# Altium schematic sheet schematic.schdoc
size 546 x 375 mm
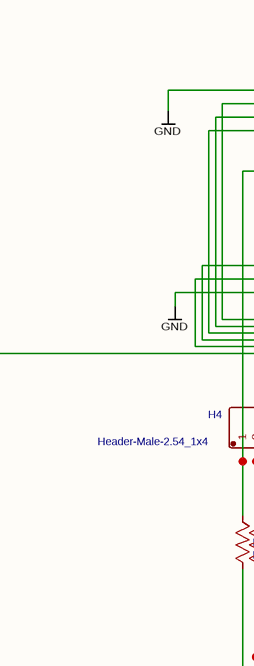
[diagram p0: schematic.schdoc, top left]
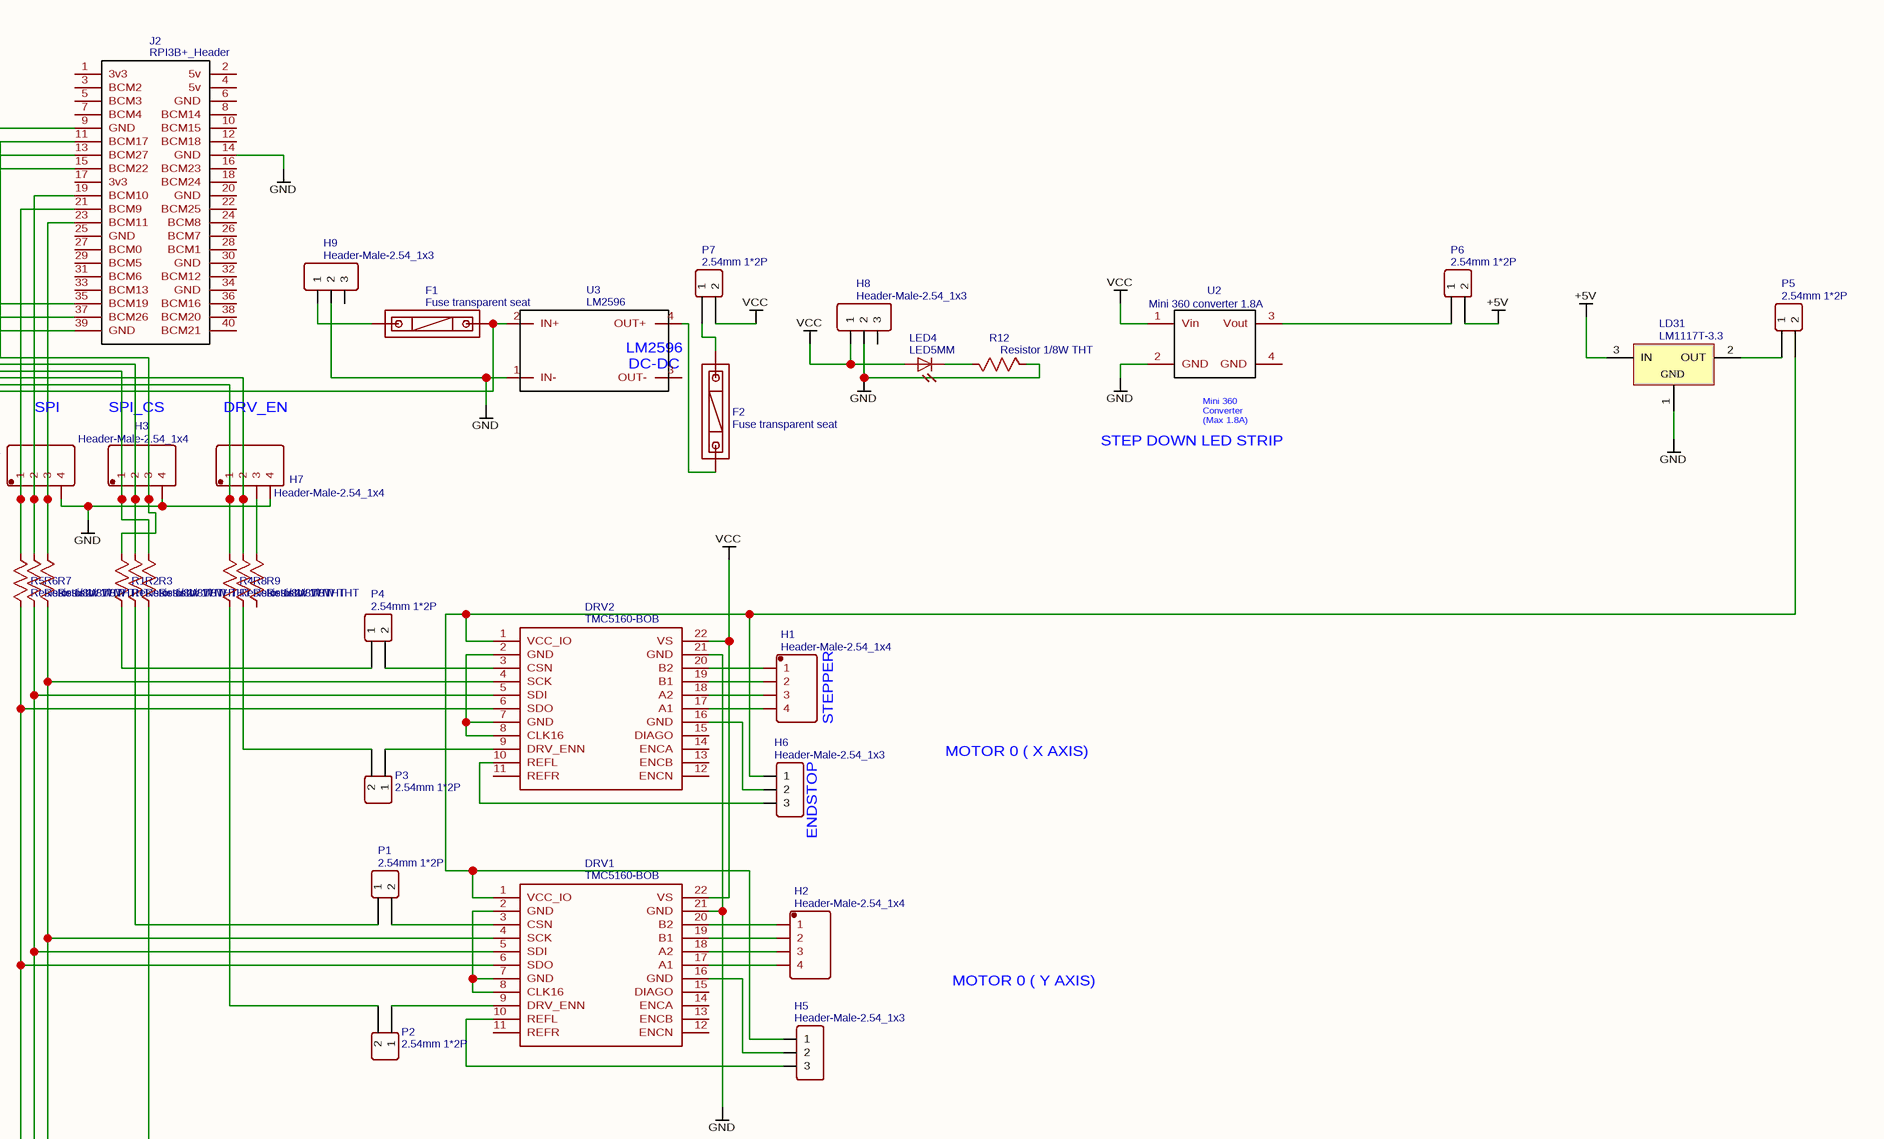
[diagram p1: schematic.schdoc, top right]
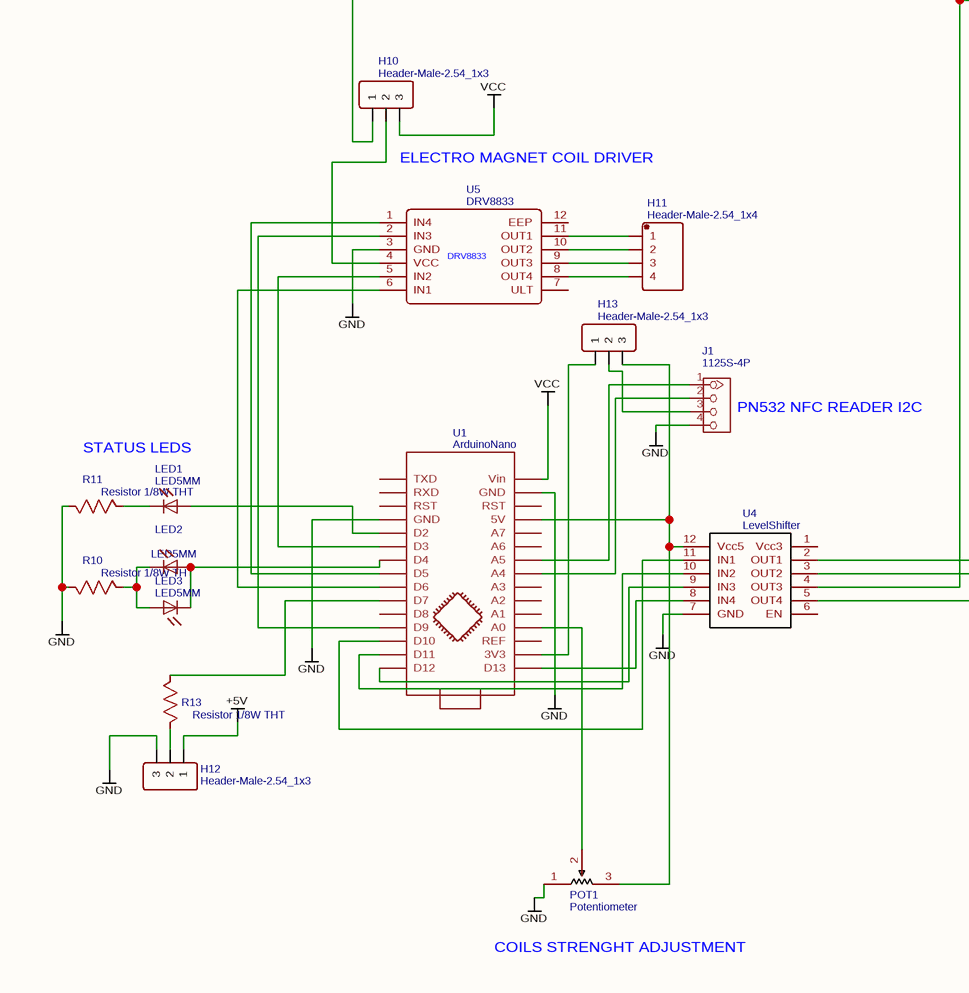
[diagram p2: schematic.schdoc, bottom left]

## Parts
DRV1  TMC5160-BOB  [TMC5160-BOB]
DRV2  TMC5160-BOB  [TMC5160-BOB]
F1  Fuse transparent seat  [FUSE-TH_L22.6-W9.0]
F2  Fuse transparent seat  [FUSE-TH_L22.6-W9.0]
H1  Header-Male-2.54_1x4  [HDR-TH_4P-P2.54-V]
H2  Header-Male-2.54_1x4  [HDR-TH_4P-P2.54-V]
H3  Header-Male-2.54_1x4  [HDR-TH_4P-P2.54-V]
H4  Header-Male-2.54_1x4  [HDR-TH_4P-P2.54-V]
H5  Header-Male-2.54_1x3  [HDR-TH_3P-P2.54-V]
H6  Header-Male-2.54_1x3  [HDR-TH_3P-P2.54-V]
H7  Header-Male-2.54_1x4  [HDR-TH_4P-P2.54-V]
H8  Header-Male-2.54_1x3  [HDR-TH_3P-P2.54-V]
H9  Header-Male-2.54_1x3  [HDR-TH_3P-P2.54-V]
H10  Header-Male-2.54_1x3  [HDR-TH_3P-P2.54-V]
H11  Header-Male-2.54_1x4  [HDR-TH_4P-P2.54-V]
H12  Header-Male-2.54_1x3  [HDR-TH_3P-P2.54-V]
H13  Header-Male-2.54_1x3  [HDR-TH_3P-P2.54-V]
J1  1125S-4P  [HW4-2.0]
J2  RPI3B+_Header  [2X20_2.54_HEADER]
LD31  LM1117T-3.3  [T03B]
LED1  LED5MM  [LED5MM]
LED2  LED5MM  [LED5MM]
LED3  LED5MM  [LED5MM]
LED4  LED5MM  [LED5MM]
P1  2.54mm 1*2P  [HDR-TH_2P-P2.54-V-M]
P2  2.54mm 1*2P  [HDR-TH_2P-P2.54-V-M]
P3  2.54mm 1*2P  [HDR-TH_2P-P2.54-V-M]
P4  2.54mm 1*2P  [HDR-TH_2P-P2.54-V-M]
P5  2.54mm 1*2P  [HDR-TH_2P-P2.54-V-M]
P6  2.54mm 1*2P  [HDR-TH_2P-P2.54-V-M]
P7  2.54mm 1*2P  [HDR-TH_2P-P2.54-V-M]
POT1  Potentiometer  [MY_POT]
R1  Resistor 1/8W THT  [RESISTOR 1/8W THT]
R2  Resistor 1/8W THT  [RESISTOR 1/8W THT]
R3  Resistor 1/8W THT  [RESISTOR 1/8W THT]
R4  Resistor 1/8W THT  [RESISTOR 1/8W THT]
R5  Resistor 1/8W THT  [RESISTOR 1/8W THT]
R6  Resistor 1/8W THT  [RESISTOR 1/8W THT]
R7  Resistor 1/8W THT  [RESISTOR 1/8W THT]
R8  Resistor 1/8W THT  [RESISTOR 1/8W THT]
R9  Resistor 1/8W THT  [RESISTOR 1/8W THT]
R10  Resistor 1/8W THT  [RESISTOR 1/8W THT]
R11  Resistor 1/8W THT  [RESISTOR 1/8W THT]
R12  Resistor 1/8W THT  [RESISTOR 1/8W THT]
R13  Resistor 1/8W THT  [RESISTOR 1/8W THT]
U1  ArduinoNano  [ARDUINO NANO VINCENT]
U2  Mini 360 converter 1.8A  [MINI 360 STEP DOWN CONVERTER 1.8A]
U3  LM2596  [STEP_DOWN_LM2596S]
U4  LevelShifter  [12PIN]
U5  DRV8833  [DRV8833 MOTOR DRIVER]

## Nets
+5V: H12.1 LD31.3(IN) P6.2
GND: DRV1.21(GND) DRV2.21(GND) H3.4 H4.4 H7.4 H8.2 H9.2 H12.3 J1.4 J2.9(GND) J2.14(GND) J2.39(GND) LD31.1(GND) POT1.1 R10.2 R11.2 R12.2 U1.4(GND) U1.29(GND) U2.2(GND) U3.1(IN-) U4.7(GND) U5.3(GND)
VCC: DRV1.22(VS) DRV2.22(VS) H8.1 H10.3 LED4.A P7.2 U1.30(Vin) U2.1(Vin)
NetDRV1_1: DRV1.1(VCC_IO) DRV2.1(VCC_IO) H5.1 H6.1 P5.2
NetDRV1_2: DRV1.2(GND) DRV1.7(GND) DRV1.8(CLK16)
NetDRV1_3: DRV1.3(CSN) P1.2
NetDRV1_4: DRV1.4(SCK) DRV2.4(SCK) R7.1 U4.5(OUT4)
NetDRV1_5: DRV1.5(SDI) DRV2.5(SDI) R6.1 U4.3(OUT2)
NetDRV1_6: DRV1.6(SDO) DRV2.6(SDO) R5.1 U4.4(OUT3)
NetDRV1_9: DRV1.9(DRV_ENN) P2.1
NetDRV1_10: DRV1.10(REFL) H5.3
NetDRV1_16: DRV1.16(GND) H5.2
NetDRV1_17: DRV1.17(A1) H2.4
NetDRV1_18: DRV1.18(A2) H2.3
NetDRV1_19: DRV1.19(B1) H2.2
NetDRV1_20: DRV1.20(B2) H2.1
NetDRV2_2: DRV2.2(GND) DRV2.7(GND) DRV2.8(CLK16)
NetDRV2_3: DRV2.3(CSN) P4.2
NetDRV2_9: DRV2.9(DRV_ENN) P3.1
NetDRV2_10: DRV2.10(REFL) H6.3
NetDRV2_16: DRV2.16(GND) H6.2
NetDRV2_17: DRV2.17(A1) H1.4
NetDRV2_18: DRV2.18(A2) H1.3
NetDRV2_19: DRV2.19(B1) H1.2
NetDRV2_20: DRV2.20(B2) H1.1
NetF1_1: F1.1 H9.1
NetF1_2: F1.2 H10.1 U3.2(IN+)
NetF2_1: F2.1 U3.4(OUT+)
NetF2_2: F2.2 P7.1
NetH3_1: H3.1 J2.15(BCM22) R3.2
NetH3_2: H3.2 J2.13(BCM27) R2.2
NetH3_3: H3.3 J2.11(BCM17) R1.2
NetH4_1: H4.1 J2.21(BCM9) R5.2
NetH4_2: H4.2 J2.19(BCM10) R6.2
NetH4_3: H4.3 J2.23(BCM11) R7.2
NetH7_1: H7.1 J2.37(BCM26) R4.2
NetH7_2: H7.2 J2.35(BCM19) R8.2
NetH7_3: H7.3 R9.2
NetH10_2: H10.2 U5.4(VCC)
NetH11_1: H11.1 U5.11(OUT1)
NetH11_2: H11.2 U5.10(OUT2)
NetH11_3: H11.3 U5.9(OUT3)
NetH11_4: H11.4 U5.8(OUT4)
NetH12_2: H12.2 R13.2
NetH13_1: H13.1 U1.17(3V3)
NetH13_2: H13.2 J1.3
NetH13_3: H13.3 POT1.3 U1.27(5V) U4.12(Vcc5)
NetJ1_1: J1.1 U1.24(A5)
NetJ1_2: J1.2 U1.23(A4)
NetLD31_2: LD31.2(OUT) P5.1
NetLED1_A: LED1.A U1.5(D2)
NetLED1_K: LED1.K(C) R11.1
NetLED2_A: LED2.A LED3.K(C) U1.7(D4)
NetLED2_K: LED2.K(C) LED3.A R10.1
NetLED4_K: LED4.K(C) R12.1
NetP1_1: P1.1 R2.1
NetP2_2: P2.2 R4.1
NetP3_2: P3.2 R8.1
NetP4_1: P4.1 R1.1
NetP6_1: P6.1 U2.3(Vout)
NetPOT1_2: POT1.2 U1.19(A0)
NetR3_1: R3.1 U4.2(OUT1)
NetR13_1: R13.1 U1.10(D7)
NetU1_6: U1.6(D3) U5.5(IN2)
NetU1_8: U1.8(D5) U5.1(IN4)
NetU1_9: U1.9(D6) U5.6(IN1)
NetU1_12: U1.12(D9) U5.2(IN3)
NetU1_13: U1.13(D10) U4.11(IN1)
NetU1_14: U1.14(D11) U4.10(IN2)
NetU1_15: U1.15(D12) U4.9(IN3)
NetU1_16: U1.16(D13) U4.8(IN4)

Not connected (* = marked no-connect by the designer): DRV1 11(REFR) 12(ENCN) 13(ENCB) 14(ENCA) 15(DIAGO); DRV2 11(REFR) 12(ENCN) 13(ENCB) 14(ENCA) 15(DIAGO); H8 3; H9 3; J2 1(3v3) 2(5v) 3(BCM2) 4(5v) 5(BCM3) 6(GND) 7(BCM4) 8(BCM14) 10(BCM15) 12(BCM18) 16(BCM23) 17(3v3) 18(BCM24) 20(GND) 22(BCM25) 24(BCM8) 25(GND) 26(BCM7) 27(BCM0) 28(BCM1) 29(BCM5) 30(GND) 31(BCM6) 32(BCM12) 33(BCM13) 34(GND) 36(BCM16) 38(BCM20) 40(BCM21); R9 1; U1 1(TXD) 2(RXD) 3(RST) 11(D8) 18(REF) 20(A1) 21(A2) 22(A3) 25(A6) 26(A7) 28(RST); U2 4(GND); U3 3(OUT-); U4 1(Vcc3) 6(EN); U5 7(ULT) 12(EEP)

## Notes on the sheet
- SPI
- SPI_CS
- DRV_EN
- STEP DOWN LED STRIP
- STEPPER
- MOTOR 0 ( X AXIS)
- (near H6) ENDSTOP
- MOTOR 0 ( Y AXIS)
- ELECTRO MAGNET COIL DRIVER
- (near J1) PN532 NFC READER I2C
- STATUS LEDS
- COILS STRENGHT ADJUSTMENT
- (in symbol LM2596) LM2596 / DC-DC
- (in symbol Mini 360 converter 1.8A) Mini 360 / Converter / (Max 1.8A)

## Library data of the parts
DRV1 DRV2 = TMC5160-BOB: BOM_Manufacturer: TRINAMIC MOTION CONTROL GmbH; Contributor: alexackerman96; spicePre: D; spiceSymbolName: TMC5160-BOB
F1 F2 = Fuse transparent seat: BOM_Manufacturer: ReliaPro; BOM_Supplier: LCSC; BOM_Manufacturer Part: Fuse transparent seat; image: //image.lceda.cn/szlcsc/C58066.jpg; BOM_Supplier Part: C58066; spicePre: F; spiceSymbolName: Fuse transparent seat
H1-H4 H7 H11 = Header-Male-2.54_1x4: BOM_Manufacturer: Ckmtw; BOM_Manufacturer Part: 210S-1*4P L=11.6MMGold-plated black; Contributor: LCSC; BOM_Supplier: LCSC; BOM_Supplier Part: C124378; spicePre: H; spiceSymbolName: Header-Male-2.54_1x4
H5 H6 H8-H10 H12 H13 = Header-Male-2.54_1x3: BOM_Manufacturer: BOOMELE; BOM_Manufacturer Part: Header2.54mm 1*3P; BOM_Supplier: LCSC; image: //image.lceda.cn/szlcsc/C49257.jpg; BOM_Supplier Part: C49257; spicePre: H; spiceSymbolName: Header-Male-2.54_1x3
J1 = 1125S-4P: description: DIP Grove; BOM_Manufacturer Part: 1125S-4P; spicePre: J; spiceSymbolName: 1125S-4P
J2 = RPI3B+_Header: BOM_Manufacturer Part: 61304021121; Contributor: boulou; BOM_Supplier: Digi-Key; BOM_Supplier Part: 732-5310-ND; link: https://www.digikey.fr/product-detail/fr/wurth-electronics-inc/61304021121/732-5310-ND/4846886; spicePre: J; spiceSymbolName: RPI3B+_Header
LD31 = LM1117T-3.3: BOM_Manufacturer: National Semiconductor; Contributor: M474; spicePre: L; spiceSymbolName: LM1117T-3.3
LED1-LED4 = LED5MM: description: LEDs; Contributor: Pinoccio; spicePre: L; spiceSymbolName: LED5MM
P1-P7 = 2.54mm 1*2P: BOM_Manufacturer: ReliaPro; BOM_Supplier: LCSC; BOM_Manufacturer Part: 2.54mm 1*2P; image: http://image.lceda.cn/szlcsc/C36717.jpg; BOM_Supplier Part: C36717; spicePre: P; spiceSymbolName: 2.54mm 1*2P
POT1 = Potentiometer: Contributor: Tommaso Mariotti; BOM_Manufacturer Part: potentiometer; spicePre: p; spiceSymbolName: Potentiometer
R1-R13 = Resistor 1/8W THT: BOM_Manufacturer: Generic; Contributor: tyvogelpohl; BOM_Manufacturer Part: Generic; BOM_Supplier: Mouser; BOM_Supplier Part: Generic; spicePre: R; spiceSymbolName: Resistor 1/8W THT
U1 = ArduinoNano: Contributor: vincint810923; BOM_Manufacturer Part: ArduinoNano; spicePre: U; spiceSymbolName: ArduinoNano
U2 = Mini 360 converter 1.8A: Contributor: Hankwon Chang (InterStellarCloud); BOM_Manufacturer Part: Mini 360 step down converter 1.8A; link: Input Voltage: 4.75V-23V  Output Voltage: 1.0V-17V  Output Current: Peak 3A, long 1.8A  Conversion Efficiency: 96% (the highest); spicePre: U; spiceSymbolName: Mini 360 converter 1.8A
U3 = LM2596: Contributor: Azriel Hutagalung; timeStamp: 1469974263; spicePre: U; spiceSymbolName: LM2596
U4 = LevelShifter: Contributor: max.helmrich; spicePre: U; spiceSymbolName: LevelShifter
U5 = DRV8833: sourceId: YsmgyP7pj; timeStamp: 1453691553; spicePre: U; spiceSymbolName: DRV8833